# Altium schematic sheet tach key h.SchDoc
size A3
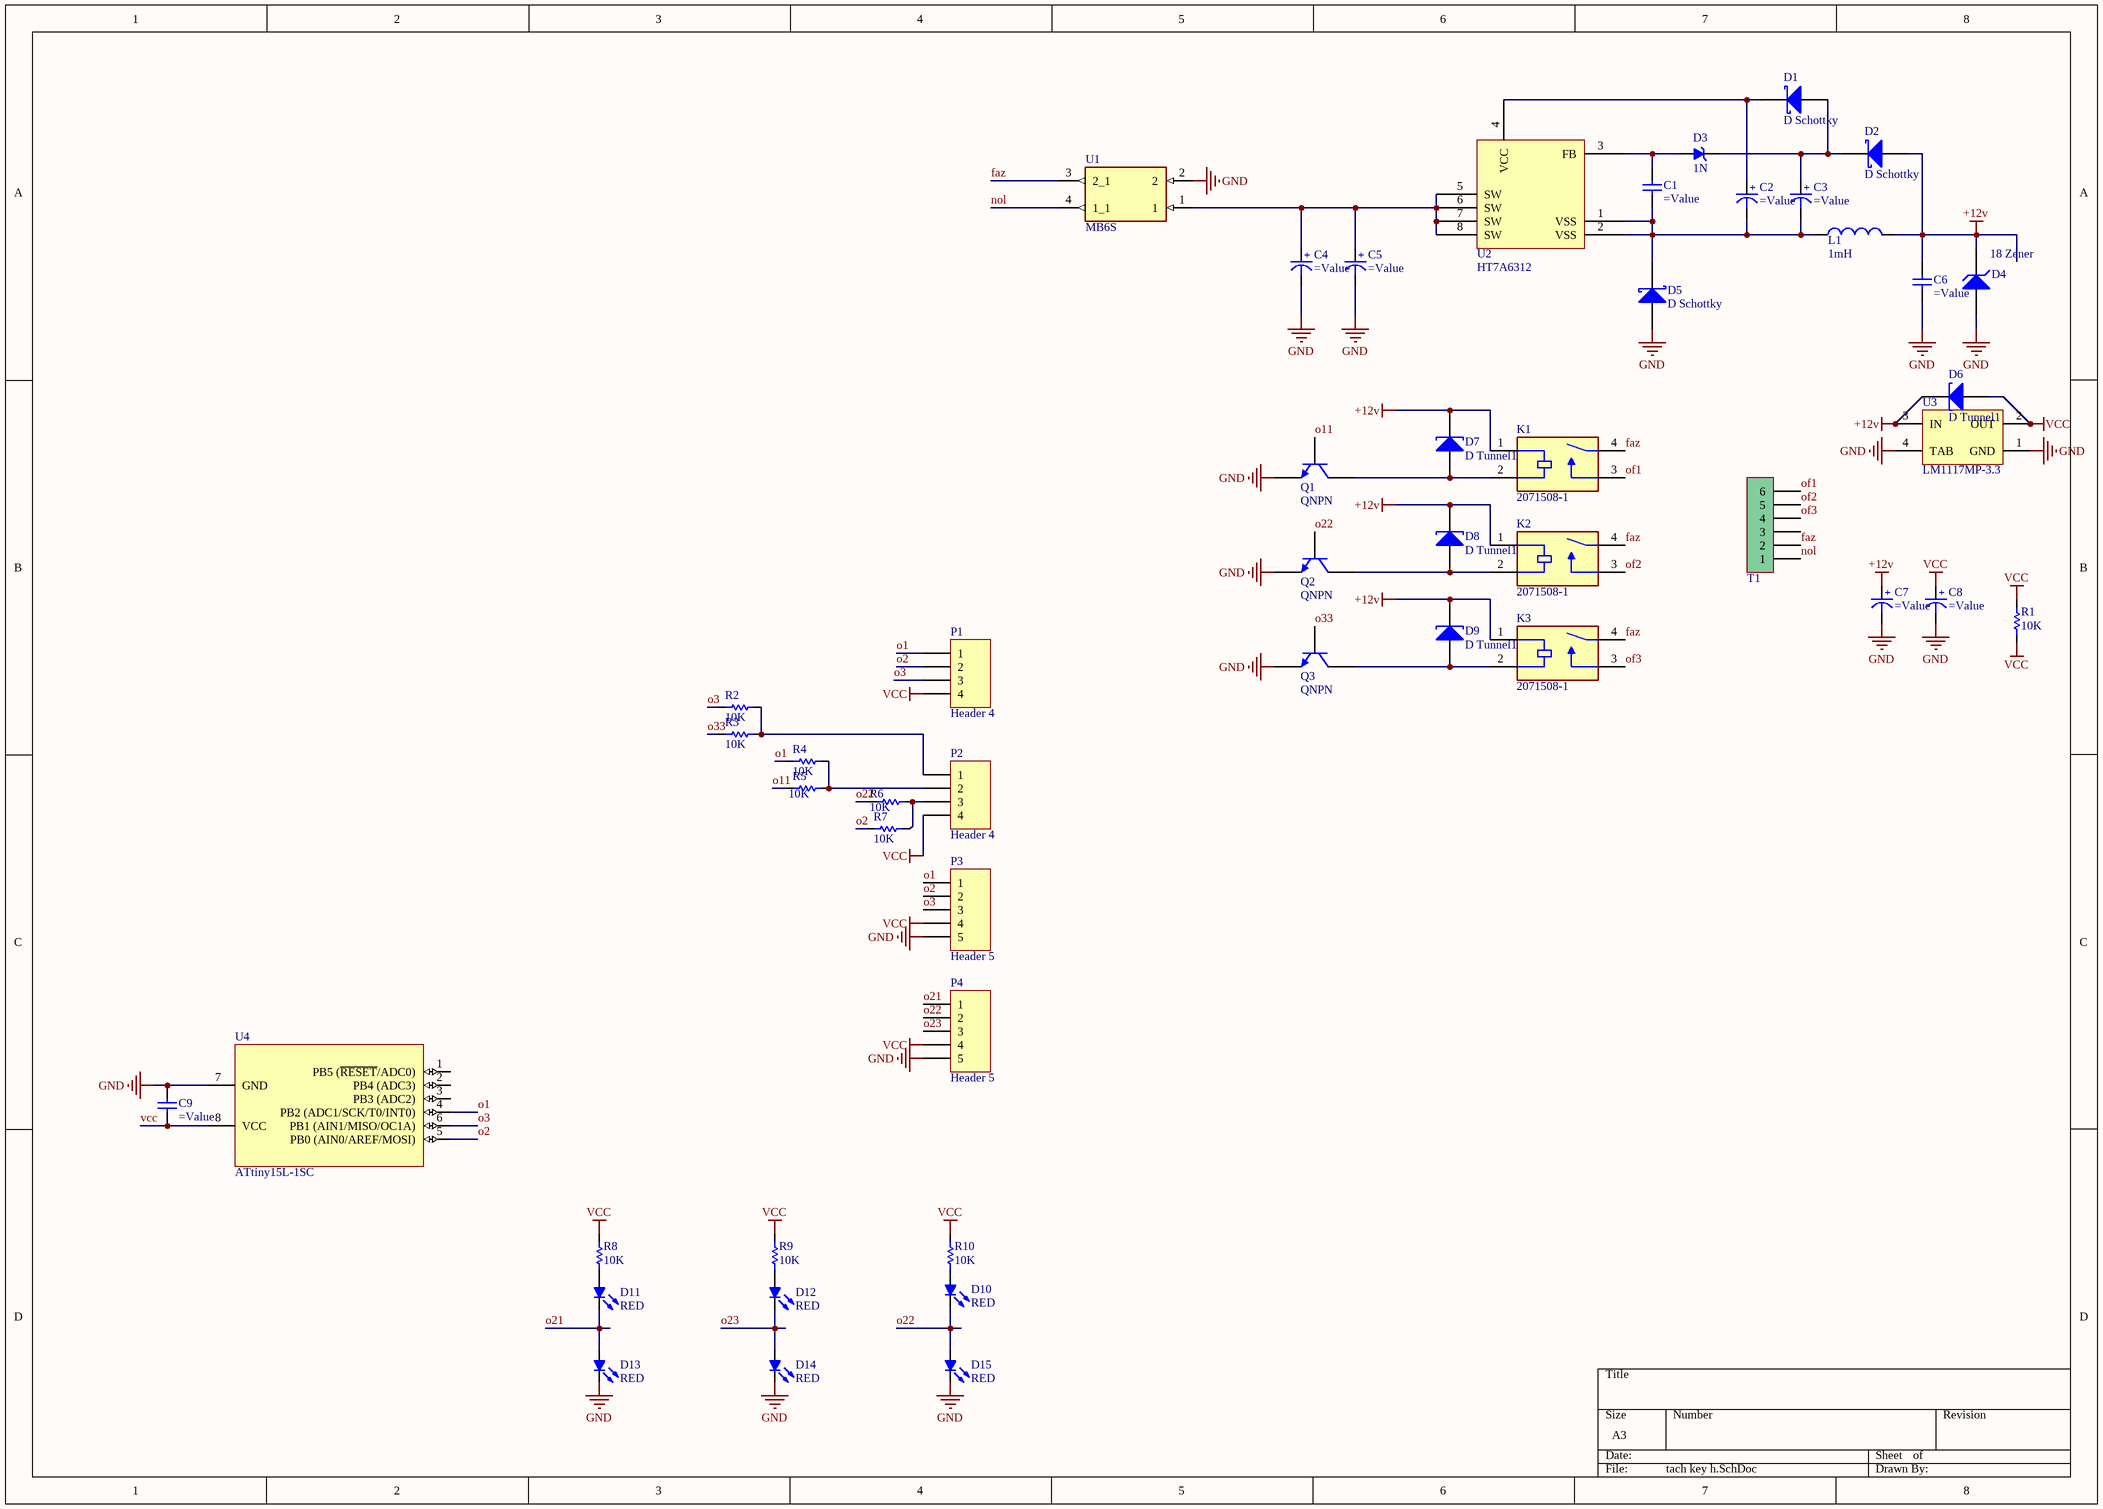
[diagram p0: tach key h.SchDoc]

## Parts
C1  (no value)  [CAP 1206]
C2  (no value)  [ELEC-CAP-RAD10-20]
C3  (no value)  [ELEC-CAP-RAD10-20]
C4  (no value)  [ELEC-CAP-RAD15-30]
C5  (no value)  [ELEC-CAP-RAD15-30]
C6  (no value)  [CAP 1206]
C7  (no value)  [ELEC-CAP-RAD15-30]
C8  (no value)  [ELEC-CAP-RAD15-30]
C9  (no value)  [CAP 1206]
D1  D Schottky  [SMB]
D2  D Schottky  [SMB]
D3  MODEL: 1N  [DO-35]  (hidden comment: Zener Diode)
D4  18 Zener  [minimelf]
D5  D Schottky  [SMB]
D6  D Tunnel1  [3.2X1.6X1.1]
D7  D Tunnel1  [3.2X1.6X1.1]
D8  D Tunnel1  [3.2X1.6X1.1]
D9  D Tunnel1  [3.2X1.6X1.1]
D10  COLOR: RED  [LEDC3216X120N]  (hidden comment: MODEL)
D11  COLOR: RED  [LEDC3216X120N]  (hidden comment: MODEL)
D12  COLOR: RED  [LEDC3216X120N]  (hidden comment: MODEL)
D13  COLOR: RED  [LEDC3216X120N]  (hidden comment: MODEL)
D14  COLOR: RED  [LEDC3216X120N]  (hidden comment: MODEL)
D15  COLOR: RED  [LEDC3216X120N]  (hidden comment: MODEL)
K1  2071508-1  [RELAY_2071508-1]
K2  2071508-1  [RELAY_2071508-1]
K3  2071508-1  [RELAY_2071508-1]
L1  1mH  [HS1101]
P1  Header 4  [HDR1X4]
P2  Header 4  [HDR1X4]
P3  Header 5  [HDR1X5]
P4  Header 5  [HDR1X5]
Q1  QNPN  [SOT-23B_L]
Q2  QNPN  [SOT-23B_L]
Q3  QNPN  [SOT-23B_L]
R1  10K  [RES 1206 (3216X08L)]
R2  10K  [RES 1206 (3216X08L)]
R3  10K  [RES 1206 (3216X08L)]
R4  10K  [RES 1206 (3216X08L)]
R5  10K  [RES 1206 (3216X08L)]
R6  10K  [RES 1206 (3216X08L)]
R7  10K  [RES 1206 (3216X08L)]
R8  10K  [RES 1206 (3216X08L)]
R9  10K  [RES 1206 (3216X08L)]
R10  10K  [RES 1206 (3216X08L)]
T1  Phoenix terminal  [phoenix terminal 6]  (value not drawn)
U1  MB6S  [SOIC245P670X270-4N]
U2  HT7A6312  [SOIC127P599X175-8N]
U3  LM1117MP-3.3  [SOT89L]
U4  ATtiny15L-1SC  [8S2_N]

## Nets
+12v: C6.1(+) C7.2(+) D2.1(A) D4.2(K) D6.2(K) D7.2(K) D8.2(K) D9.2(K) K1.1(COIL1) K2.1(COIL1) K3.1(COIL1) L1.2 U3.3(IN)
GND: C4.1(-) C5.1(-) C6.2(-) C7.1(-) C8.1(-) C9.2(-) D4.1(A) D5.1(A) D13.2(K) D14.2(K) D15.2(K) P3.5 P4.5 Q1.3(E) Q2.3(E) Q3.3(E) U1.2 U3.1(GND) U3.4(TAB) U4.7(GND)
vcc: C8.2(+) C9.1(+) D6.1(A) P1.4 P2.4 P3.4 P4.4 R1.1 R1.2 R8.2 R9.2 R10.2 U3.2(OUT) U4.8(VCC)
faz: K1.4(COM) K2.4(COM) K3.4(COM) T1.2 U1.3(2_1)
nol: T1.1 U1.4(1_1)
o1: P1.1 P3.1 R4.1 U4.4(PB2_(ADC1/SCK/T0/INT0))
o2: P1.2 P3.2 R7.1 U4.5(PB0_(AIN0/AREF/MOSI))
o3: P1.3 P3.3 R2.1 U4.6(PB1_(AIN1/MISO/OC1A))
o11: Q1.2(B) R5.1
o21: D11.2(K) D13.1(A) P4.1
o22: D10.2(K) D15.1(A) P4.2 Q2.2(B) R6.1
o23: D12.2(K) D14.1(A) P4.3
o33: Q3.2(B) R3.1
of1: K1.3(NO) T1.6
of2: K2.3(NO) T1.5
of3: K3.3(NO) T1.4
NetC1_1: C1.1(+) D3.1(A) U2.3(FB)
NetC1_2: C1.2(-) C2.1(-) C3.1(-) D5.2(K) L1.1 U2.1(VSS) U2.2(VSS)
NetC2_2: C2.2(+) D1.2(K) U2.4(VCC)
NetC3_2: C3.2(+) D1.1(A) D2.2(K) D3.2(K)
NetC4_2: C4.2(+) C5.2(+) U1.1 U2.5(SW) U2.6(SW) U2.7(SW) U2.8(SW)
NetD7_1: D7.1(A) K1.2(COIL2) Q1.1(C)
NetD8_1: D8.1(A) K2.2(COIL2) Q2.1(C)
NetD9_1: D9.1(A) K3.2(COIL2) Q3.1(C)
NetD10_1: D10.1(A) R10.1
NetD11_1: D11.1(A) R8.1
NetD12_1: D12.1(A) R9.1
NetP2_1: P2.1 R2.2 R3.2
NetP2_2: P2.2 R4.2 R5.2
NetP2_3: P2.3 R6.2 R7.2

Not connected (* = marked no-connect by the designer): T1 3; U4 1(PB5_(~{RESET}/ADC0)) 2(PB4_(ADC3)) 3(PB3_(ADC2))

## Library data of the parts
C1 C6 C9 = Capacitor
C2-C5 C7 C8 = Capacitor Electrolytic: Electrolytic Capacitor
D1 D2 D5 = D Schottky: Schottky Diode; Published: 8-Jun-2000; LatestRevisionDate: 17-Jul-2002; LatestRevisionNote: Re-released for DXP Platform.; PackageReference: SMB; Publisher: Altium Limited; PackageDescription: DO-214-AA/SMB; 2 C-Bend Leads; Body 5.3 x 3.6 mm, inc. leads (LxW); Code_JEDEC: DO-214-AA
D4 = D Zener: Zener Diode; Published: 8-Jun-2000; LatestRevisionDate: 17-Jul-2002; LatestRevisionNote: Re-released for DXP Platform.; PackageReference: DIODE-0.7; Publisher: Altium Limited
D6-D9 = D Tunnel1: Tunnel Diode - RLC Model; Published: 8-Jun-2000; LatestRevisionDate: 17-Jul-2002; LatestRevisionNote: Re-released for DXP Platform.; PackageVersion: Feb-2002; PackageReference: 3.2X1.6X1.1; Publisher: Altium Limited; PackageDescription: SM LED; 2 Flat Leads
D10-D15 = LED 5mm: Typical LED
K1-K3 = 2071508-1: Power Relay 5VDC 10A SPST-NO(18.2mm 10.2mm 15.2mm) THT; MF: TE Connectivity; Price: None; Value: *; Package: Package; SnapEDA_Link: https://www.snapeda.com/parts/2071508-1/TE%20Connectivity/view-part/4717165/?ref=snap; Availability: Unavailable; MP: 2071508-1
L1 = Inductor: Code_IEC: 1005; Published: 8-Jun-2000; LatestRevisionDate: 17-Jul-2002; LatestRevisionNote: Re-released for DXP Platform.; PackageReference: 0402-A; Publisher: Altium Limited; Code_JEITA: 0402; Value: 1mH
P1 P2 = Header 4: Header, 4-Pin; LatestRevisionDate: 17-Jul-2002; LatestRevisionNote: Re-released for DXP Platform.; Publisher: Altium Limited
P3 P4 = Header 5: Header, 5-Pin; LatestRevisionDate: 17-Jul-2002; LatestRevisionNote: Re-released for DXP Platform.; Publisher: Altium Limited
Q1-Q3 = QNPN: NPN Bipolar Transistor; pin to pad: 1>3 2>1 3>2; Published: 8-Jun-2000; LatestRevisionDate: 29-May-2009; LatestRevisionNote: IPC-7351 Footprint Added.; PackageVersion: Aug-1999; PackageReference: SOT-23B; Publisher: Altium Limited; PackageDescription: 3-Pin SOT-23 Package 0.95 mm Pitch, 2.4 mm Lead Span
R1-R10 = Resistor: Tolerance: 5%; Power: 1/4 W; Value: 10K
T1 = Phoenix terminal 6: Terminal 6 Pin; Designer: Seyed Mohsen Ghasemain; E-mail: picpars@gmail.com; ComponentLinkURL: www.picpars.com
U1 = MB6S: Bridge Rectifier Single Phase Standard 600V Surface Mount 4-SOIC; MF: ON Semiconductor; Digi-Key_Purchase_URL: https://www.digikey.com.tr/product-detail/en/on-semiconductor/MB6S/MB6SCT-ND/965654?utm_source=snapeda&utm_medium=aggregator&utm_campaign=symbol; Value: *; Package: BESOP-4 Surge Components; Digi-Key_Part_Number: MB6SCT-ND; SnapEDA_Link: https://www.snapeda.com/parts/MB6S/ON%20Semiconductor/view-part/2774209/?ref=snap; MP: MB6S
U2 = Component_1
U3 = LM1117MP-3.3: 800mA Low-Dropout Linear Regulator; pin to pad: 1>2 2>1; Manufacturer: National Semiconductor; CompType: LDO IC; PackageTopMarking: XYTT*N05A; PowerWise: N; Published: 4-Dec-2008; DatasheetVersion: Apr-2006; PackageVersion: revB, Apr-2003; PackageReference: MP04A; Publisher: Altium Limited; PackageDescription: Molded SOT-223, 6.50 x 3.56 x 1.6mm Body, 4 Lead, 2.3mm Pitch; PartNumber: LM1117MP-3.3; RoHS: O; PinCount: 4; DigiKeyPartNumber: LM1117MP-3.3CT-ND; Code_JEDEC: TO-261-AA; Code_IPC: SOT223-4; ComponentLink1Description: LM1117 Datasheet; ComponentLink1URL: http://www.national.com/ds/LM/LM1117.pdf; ComponentLink2Description: LM1117 Web Page; ComponentLink2URL: http://www.national.com/pf/LM/LM1117.html; ComponentLink3Description: MP04A Package Page; ComponentLink3URL: http://www.national.com/packaging/folders/mp04a.html
U4 = ATtiny15L-1SC: 8-Bit AVR Microcontroller with 1K Byte of Flash Memory; Published: 17-Sep-2003; LatestRevisionDate: 16-Oct-2006; LatestRevisionNote: IPC-7351 Footprint Added.; DatasheetVersion: 1187E-AVR-06/02; PackageVersion: revF, Apr-2008; PackageReference: 8S2; Publisher: Altium Limited; PackageDescription: 8-Lead, 0.208" Body, Plastic Small Outline Package (EIAJ); Supplier 1: Digi-Key; Supplier Part Number 1: ATTINY15L-1SC-ND; Supplier 2: Mouser; Supplier Part Number 2: 556-ATTINY15L1SC; ComponentLink1Description: Datasheet; ComponentLink1URL: http://www.atmel.com/dyn/resources/prod_documents/doc1187.pdf; ComponentLink2Description: Atmel.com Home; ComponentLink2URL: http://www.atmel.com